# Altium schematic sheet HDx_Mapping.SchDoc
size A3; SheetNumber: 5; SheetTotal: 5
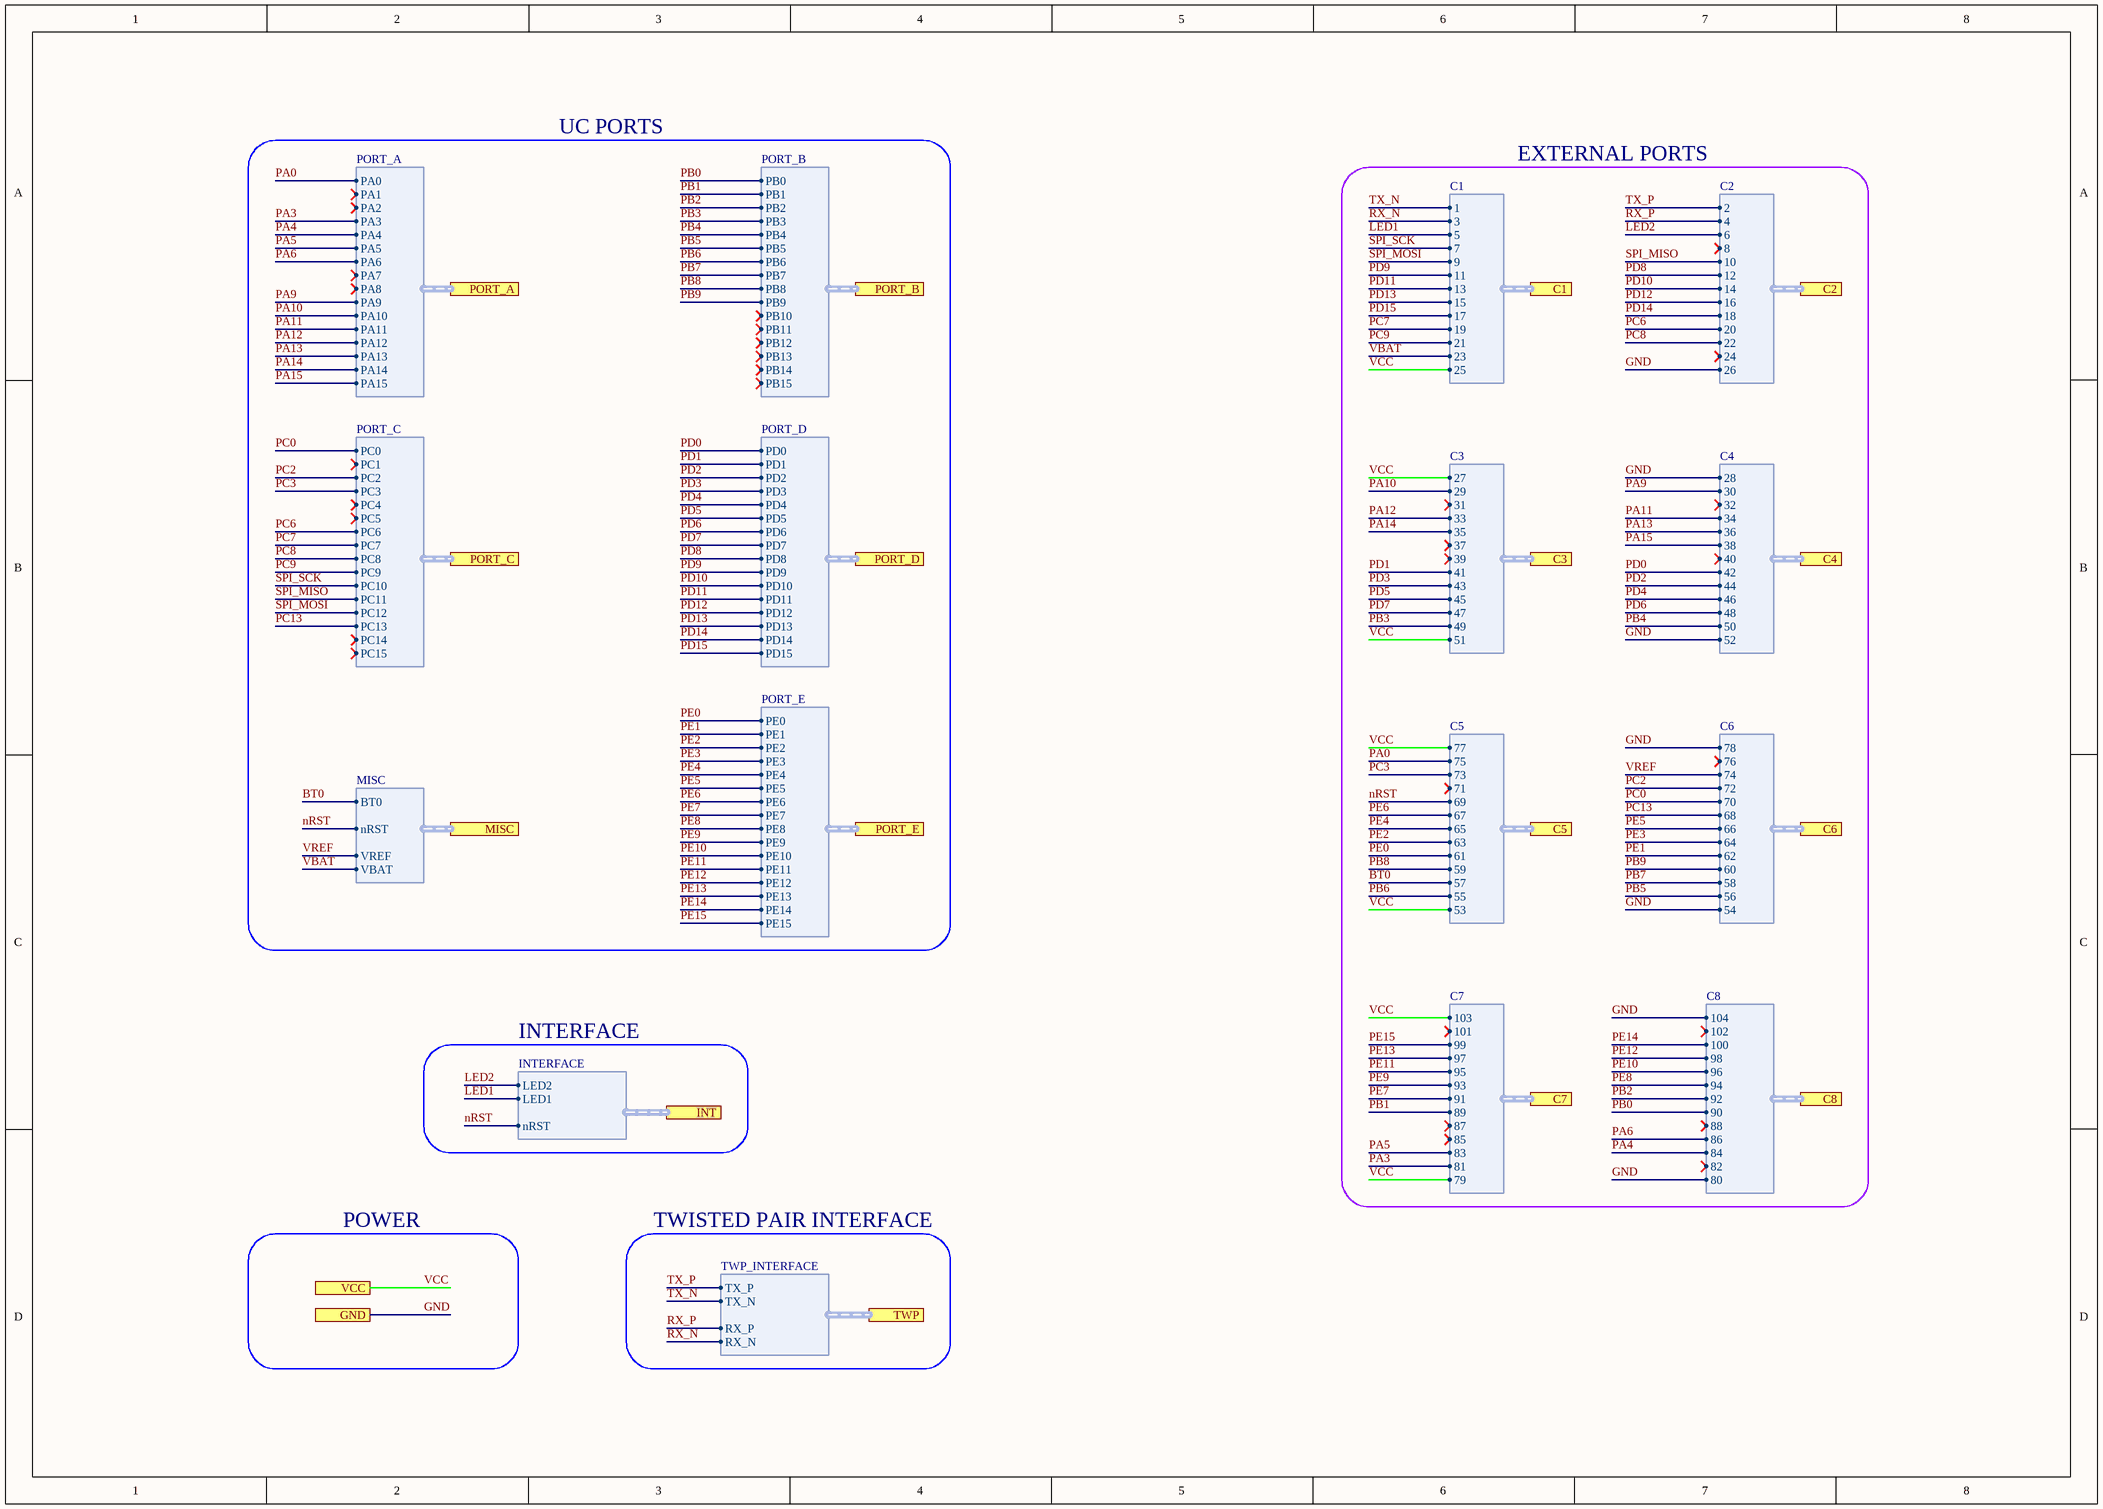
[diagram p0: HDx_Mapping.SchDoc]

## Ports
C1 (harness C1, see MCU_Board_top[3B], HDx_Interface[1B]), C2 (harness C2, see MCU_Board_top[3B], HDx_Interface[2B]), C3 (harness C3, see MCU_Board_top[3B], HDx_Interface[2C]), C4 (harness C4, see MCU_Board_top[3B], HDx_Interface[3C]), C5 (harness C5, see MCU_Board_top[3B], HDx_Interface[4B]), C6 (harness C6, see MCU_Board_top[3B], HDx_Interface[3B]), C7 (harness C7, see MCU_Board_top[3C], HDx_Interface[3A]), C8 (harness C8, see MCU_Board_top[3C], HDx_Interface[2A]), GND (see MCU_Board_top[3C], ETH_Interface[1C], UC_Interface[1C]), INT (harness INTERFACE, see MCU_Board_top[3B], ETH_Interface[4B]), MISC (harness MISC, see MCU_Board_top[3C], UC_Interface[6B]), PORT_A (harness PORT_A, see MCU_Board_top[3B], UC_Interface[4A]), PORT_B (harness PORT_B, see MCU_Board_top[3B], UC_Interface[5A]), PORT_C (harness PORT_C, see MCU_Board_top[3B], UC_Interface[7A]), PORT_D (harness PORT_D, see MCU_Board_top[3B], UC_Interface[4B]), PORT_E (harness PORT_E, see MCU_Board_top[3B], UC_Interface[5B]), TWP (harness TWP_INTERFACE, see MCU_Board_top[3B], ETH_Interface[4A]), VCC (see MCU_Board_top[3B], ETH_Interface[1C], UC_Interface[1C])

## Harnesses
C1: 1, 3, 5, 7, 9, 11, 13, 15, 17, 19, 21, 23, 25
PORT_A: PA0, PA1, PA2, PA3, PA4, PA5, PA6, PA7, PA8, PA9, PA10, PA11, PA12, PA13, PA14, PA15
C2: 2, 4, 6, 8, 10, 12, 14, 16, 18, 20, 22, 24, 26
C3: 27, 29, 31, 33, 35, 37, 39, 41, 43, 45, 47, 49, 51
C4: 28, 30, 32, 34, 36, 38, 40, 42, 44, 46, 48, 50, 52
C5: 77, 75, 73, 71, 69, 67, 65, 63, 61, 59, 57, 55, 53
C6: 78, 76, 74, 72, 70, 68, 66, 64, 62, 60, 58, 56, 54
C7: 103, 101, 99, 97, 95, 93, 91, 89, 87, 85, 83, 81, 79
C8: 104, 102, 100, 98, 96, 94, 92, 90, 88, 86, 84, 82, 80
PORT_B: PB0, PB1, PB2, PB3, PB4, PB5, PB6, PB7, PB8, PB9, PB10, PB11, PB12, PB13, PB14, PB15
PORT_C: PC0, PC1, PC2, PC3, PC4, PC5, PC6, PC7, PC8, PC9, PC10, PC11, PC12, PC13, PC14, PC15
PORT_D: PD0, PD1, PD2, PD3, PD4, PD5, PD6, PD7, PD8, PD9, PD10, PD11, PD12, PD13, PD14, PD15
PORT_E: PE0, PE1, PE2, PE3, PE4, PE5, PE6, PE7, PE8, PE9, PE10, PE11, PE12, PE13, PE14, PE15
MISC: BT0, nRST, VREF, VBAT
TWP_INTERFACE: TX_P, TX_N, RX_P, RX_N
INTERFACE: LED2, LED1, nRST

## Nets
BT0: port C5.57, port MISC.BT0
GND: port GND, port C2.26, port C4.28, port C4.52, port C6.78, port C6.54, port C8.104, port C8.80
LED1: port C1.5, port INT.LED1
LED2: port C2.6, port INT.LED2
nRST: port C5.69, port MISC.nRST, port INT.nRST
PA0: port PORT_A.PA0, port C5.75
PA3: port PORT_A.PA3, port C7.81
PA4: port PORT_A.PA4, port C8.84
PA5: port PORT_A.PA5, port C7.83
PA6: port PORT_A.PA6, port C8.86
PA9: port PORT_A.PA9, port C4.30
PA10: port PORT_A.PA10, port C3.29
PA11: port PORT_A.PA11, port C4.34
PA12: port PORT_A.PA12, port C3.33
PA13: port PORT_A.PA13, port C4.36
PA14: port PORT_A.PA14, port C3.35
PA15: port PORT_A.PA15, port C4.38
PB0: port C8.90, port PORT_B.PB0
PB1: port C7.89, port PORT_B.PB1
PB2: port C8.92, port PORT_B.PB2
PB3: port C3.49, port PORT_B.PB3
PB4: port C4.50, port PORT_B.PB4
PB5: port C6.56, port PORT_B.PB5
PB6: port C5.55, port PORT_B.PB6
PB7: port C6.58, port PORT_B.PB7
PB8: port C5.59, port PORT_B.PB8
PB9: port C6.60, port PORT_B.PB9
PC0: port C6.70, port PORT_C.PC0
PC2: port C6.72, port PORT_C.PC2
PC3: port C5.73, port PORT_C.PC3
PC6: port C2.20, port PORT_C.PC6
PC7: port C1.19, port PORT_C.PC7
PC8: port C2.22, port PORT_C.PC8
PC9: port C1.21, port PORT_C.PC9
PC13: port C6.68, port PORT_C.PC13
PD0: port C4.42, port PORT_D.PD0
PD1: port C3.41, port PORT_D.PD1
PD2: port C4.44, port PORT_D.PD2
PD3: port C3.43, port PORT_D.PD3
PD4: port C4.46, port PORT_D.PD4
PD5: port C3.45, port PORT_D.PD5
PD6: port C4.48, port PORT_D.PD6
PD7: port C3.47, port PORT_D.PD7
PD8: port C2.12, port PORT_D.PD8
PD9: port C1.11, port PORT_D.PD9
PD10: port C2.14, port PORT_D.PD10
PD11: port C1.13, port PORT_D.PD11
PD12: port C2.16, port PORT_D.PD12
PD13: port C1.15, port PORT_D.PD13
PD14: port C2.18, port PORT_D.PD14
PD15: port C1.17, port PORT_D.PD15
PE0: port C5.61, port PORT_E.PE0
PE1: port C6.62, port PORT_E.PE1
PE2: port C5.63, port PORT_E.PE2
PE3: port C6.64, port PORT_E.PE3
PE4: port C5.65, port PORT_E.PE4
PE5: port C6.66, port PORT_E.PE5
PE6: port C5.67, port PORT_E.PE6
PE7: port C7.91, port PORT_E.PE7
PE8: port C8.94, port PORT_E.PE8
PE9: port C7.93, port PORT_E.PE9
PE10: port C8.96, port PORT_E.PE10
PE11: port C7.95, port PORT_E.PE11
PE12: port C8.98, port PORT_E.PE12
PE13: port C7.97, port PORT_E.PE13
PE14: port C8.100, port PORT_E.PE14
PE15: port C7.99, port PORT_E.PE15
RX_N: port C1.3, port TWP.RX_N
RX_P: port C2.4, port TWP.RX_P
SPI_MISO: port C2.10, port PORT_C.PC11
SPI_MOSI: port C1.9, port PORT_C.PC12
SPI_SCK: port C1.7, port PORT_C.PC10
TX_N: port C1.1, port TWP.TX_N
TX_P: port C2.2, port TWP.TX_P
VBAT: port C1.23, port MISC.VBAT
VCC: port VCC, port C1.25, port C3.27, port C3.51, port C5.77, port C5.53, port C7.103, port C7.79
VREF: port C6.74, port MISC.VREF

## Notes on the sheet
- UC PORTS
- EXTERNAL PORTS
- INTERFACE
- POWER
- TWISTED PAIR INTERFACE